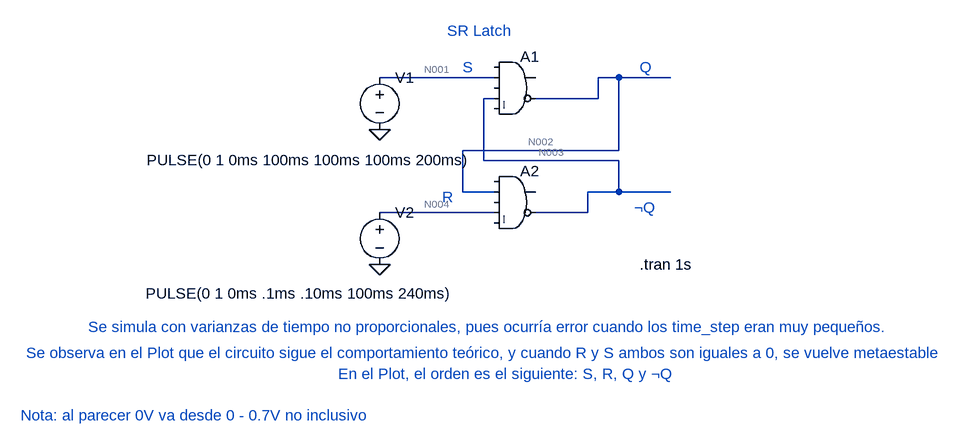
[diagram p0: schematic Lab_01_5.asc]
Lab_01_5.asc, the LTspice schematic file:
Version 4
SHEET 1 1036 680
WIRE 240 48 64 48
WIRE 432 48 400 48
WIRE 512 48 432 48
WIRE 240 80 224 80
WIRE 400 80 400 48
WIRE 400 80 304 80
WIRE 432 160 432 48
WIRE 432 160 192 160
WIRE 224 176 224 80
WIRE 432 176 224 176
WIRE 192 224 192 160
WIRE 240 224 192 224
WIRE 432 224 432 176
WIRE 432 224 384 224
WIRE 512 224 432 224
WIRE 240 256 64 256
WIRE 384 256 384 224
WIRE 384 256 304 256
FLAG 64 128 0
FLAG 64 336 0
SYMBOL Digital\\and 272 0 R0
SYMATTR InstName A1
SYMBOL Digital\\and 272 176 R0
SYMATTR InstName A2
SYMBOL voltage 64 32 R0
WINDOW 3 -358 143 Left 2
WINDOW 123 0 0 Left 0
WINDOW 39 0 0 Left 0
SYMATTR Value PULSE(0 1 0ms 100ms 100ms 100ms 200ms)
SYMATTR InstName V1
SYMBOL voltage 64 240 R0
WINDOW 3 -360 140 Left 2
WINDOW 123 0 0 Left 0
WINDOW 39 0 0 Left 0
SYMATTR Value PULSE(0 1 0ms .1ms .10ms 100ms 240ms)
SYMATTR InstName V2
TEXT 464 336 Left 2 !.tran 1s
TEXT 464 32 Left 2 ;Q
TEXT 456 248 Left 2 ;¬Q
TEXT 168 -24 Left 2 ;SR Latch
TEXT -384 432 Left 2 ;Se simula con varianzas de tiempo no proporcionales, pues ocurría error cuando los time_step eran muy pequeños.
TEXT -480 472 Left 2 ;Se observa en el Plot que el circuito sigue el comportamiento teórico, y cuando R y S ambos son iguales a 0, se vuelve metaestable
TEXT -488 568 Left 2 ;Nota: al parecer 0V va desde 0 - 0.7V no inclusivo
TEXT 192 32 Left 2 ;S
TEXT 160 232 Left 2 ;R
TEXT 0 504 Left 2 ;En el Plot, el orden es el siguiente: S, R, Q y ¬Q

The netlist it stands for:
* Lab_01_5.asc
A1 0 N001 0 N003 0 N002 0 0 AND
A2 0 N002 0 N004 0 N003 0 0 AND
V1 N001 0 PULSE(0 1 0ms 100ms 100ms 100ms 200ms)
V2 N004 0 PULSE(0 1 0ms .1ms .10ms 100ms 240ms)
.tran 1s
* Q
* ¬Q
* SR Latch
* Se simula con varianzas de tiempo no proporcionales, pues ocurría error cuando los time_step eran muy pequeños.
* Se observa en el Plot que el circuito sigue el comportamiento teórico, y cuando R y S ambos son iguales a 0, se vuelve metaestable
* Nota: al parecer 0V va desde 0 - 0.7V no inclusivo
* S
* R
* En el Plot, el orden es el siguiente: S, R, Q y ¬Q
.backanno
.end

* Results of the author's LTspice run, read from the files saved beside the schematic
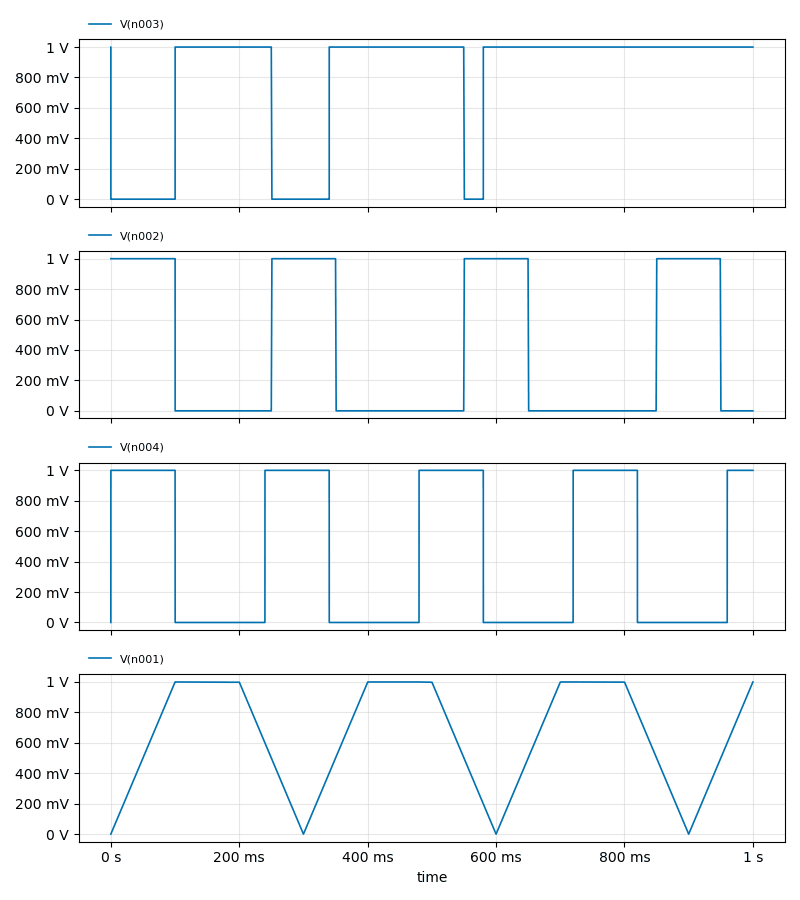
[diagram p1: Transient Analysis of Lab_01_5.asc, plotted from the saved traces]
* Transient Analysis, 1 run:
*   V(n003): min 0 V, max 1 V, average 780.1 mV, rms 883.2 mV, last 1 V
*   V(n002): min 0 V, max 1 V, average 400.3 mV, rms 632.7 mV, last 0 V
*   V(n004): min 0 V, max 1 V, average 440.4 mV, rms 663.5 mV, last 1 V
*   V(n001): min 0 V, max 1 V, average 649.7 mV, rms 753.5 mV, last 1 V